# EAGLE design oc_oscillator (EAGLE 9.6.2)
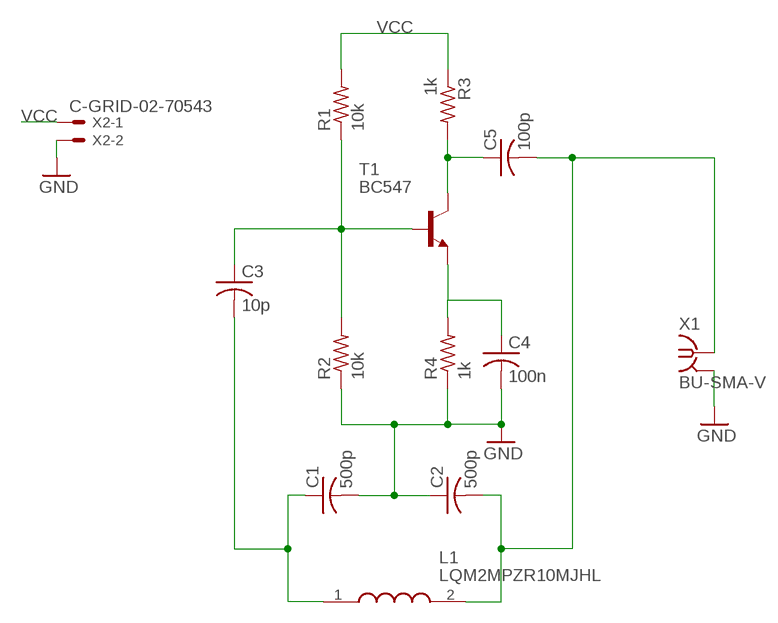
[diagram p0: schematic, sheet 1]

## Parts
C1  500p  C-USC0805  [C0805]
C2  500p  C-USC0805  [C0805]
C3  10p  C-USC0805  [C0805]
C4  100n  C-USC0805  [C0805]
C5  100p  C-USC0805  [C0805]
L1  LQM2MPZR10MJHL  [INDC2016X120N]
R1  10k  R-US_M0805  [M0805]
R2  10k  R-US_M0805  [M0805]
R3  1k  R-US_M0805  [M0805]
R4  1k  R-US_M0805  [M0805]
T1  BC547  [TO92]
X1  BU-SMA-V  [BU-SMA-V]
X2  C-GRID-02-70543  [70543-02]

## Nets
GND: C1.2 C2.1 C4.2 R2.1 R4.1 X1.2 X1.3 X1.4 X1.5 X2.2
N$1: C4.1 R4.2 T1.1(E)
N$2: C5.1 R3.2 T1.3(C)
N$3: C3.1 R1.1 R2.2 T1.2(B)
N$5: C1.1 C3.2 L1.1
N$6: C2.2 C5.2 L1.2 X1.1
VCC: R1.2 R3.1 X2.1

## Library data of the parts
C1-C5 = rcl:C-US: CAPACITOR, American symbol; SPICEPREFIX: C
L1 = LQM2MPZR10MJHL:LQM2MPZR10MJHL: LQM2MPZ_JH Series Inductor 0.1uH +/-20% 0806 (2016) Source: Datasheet <https://psearch.en.murata.com/inductor/product/LQM2MPZR10MJH#.html>; DESCRIPTION: LQM2MPZ_JH Series Inductor 0.1uH +/-20% 0806 (2016); HEIGHT: 1.2mm; MANUFACTURER_NAME: Murata Electronics; MANUFACTURER_PART_NUMBER: LQM2MPZR10MJHL; MOUSER_PART_NUMBER: 81-LQM2MPZR10MJHL; MOUSER_PRICE-STOCK: https://www.mouser.co.uk/ProductDetail/Murata-Electronics/LQM2MPZR10MJHL?qs=d0WKAl%252BL4KZJ7ssacSrcEg%3D%3D
R1-R4 = rcl:R-US_: RESISTOR, American symbol; SPICEPREFIX: R
T1 = transistor:BC547: NPN TRANSISTOR
X1 = con-coax:BU-SMA-V: FEMALE SMA CONNECTOR Radiall distributor RS 112-3794; OC_FARNELL: unknown; OC_NEWARK: unknown
X2 = con-molex:C-GRID-02: CONNECTOR wire to board 2.54 mm (0.100") pitch header; MF: MOLEX; OC_FARNELL: unknown; OC_NEWARK: unknown

## Board
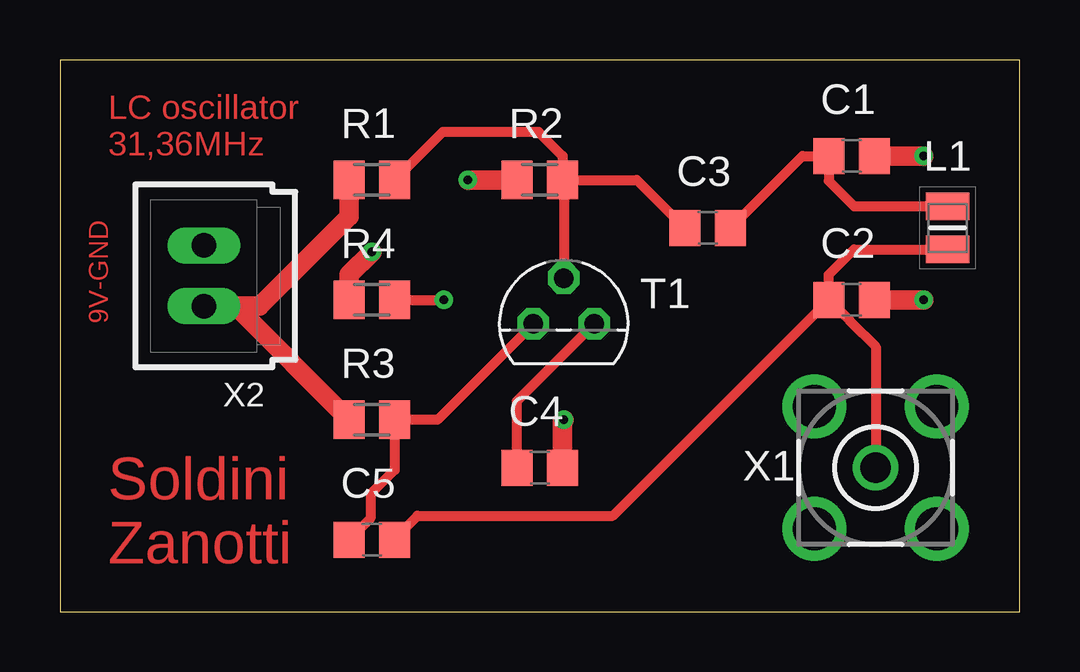
[diagram p1: board, top side]
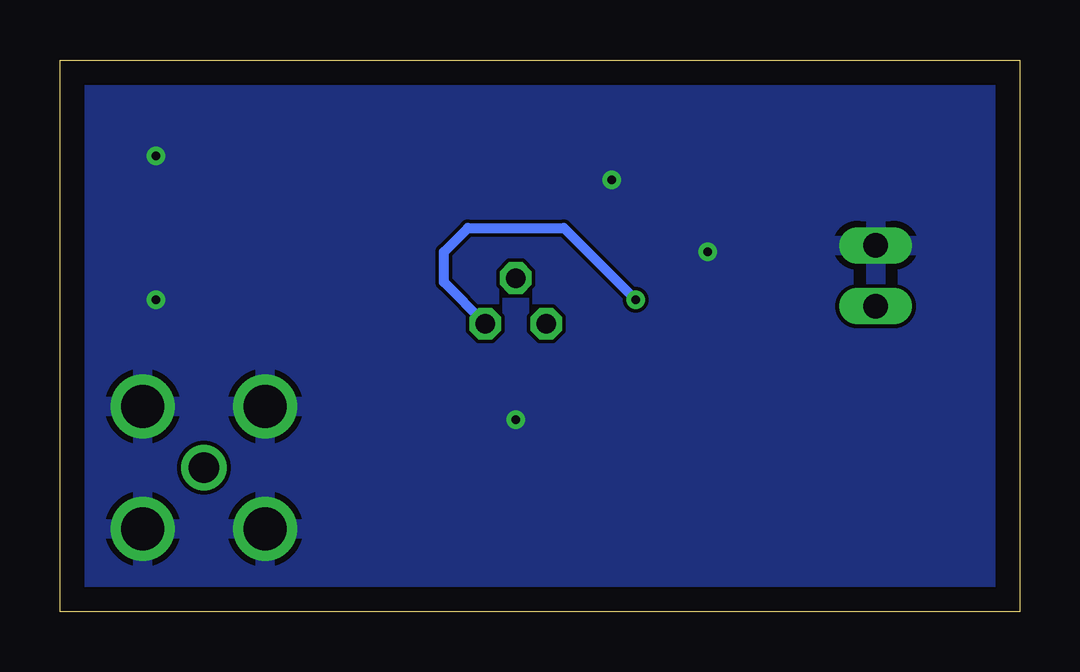
[diagram p2: board, bottom side, seen from below]

Size 40 x 23 mm. Coordinates in mm from the lower left corner, seen from the top.
Outline: 0,0 40,0 40,23 0,23 0,0
Copper layers (1*16): Top 0.035mm / dielectric 1.5mm / Bottom 0.035mm
Design rules "default": minimum track width 6mil, minimum drill 0.35mm, track to track 6mil, track to pad 6mil, pad to pad 6mil, via to via 6mil, smd to smd 6mil, copper to edge 40mil, drill to drill 6mil, minimum pad ring 10mil, minimum via ring 8mil, stop-mask expansion 4mil, vias tented up to drill 0mil, thermal gap 10mil

### Footprints (pad centres in the part's own frame; a part is rotated, then mirrored left to right if it is on the bottom)
C0805 = smd 1.3 x 1.5: 1 -0.95,0; 2 0.95,0
INDC2016X120N = smd 1.15 x 1.8: 1 -0.9,0; 2 0.9,0
M0805 = smd 1.3 x 1.6: 1 -0.95,0; 2 0.95,0
TO92 = drill 0.813 octagon: 1 1.27,0; 2 0,1.905; 3 -1.27,0
BU-SMA-V = drill 1.27: 1 0,0 | drill 1.778: 2 -2.55,2.55; 3 2.55,2.55; 4 2.55,-2.55; 5 -2.55,-2.55
70543-02 = drill 1.016 long: 1 -1.27,0; 2 1.27,0

### Placement (x,y rotation side)
C1  33,19 0 top
C2  33,13 180 top
C3  27,16 0 top
C4  20,6 0 top
C5  13,3 0 top
L1  37,16 270 top
R1  13,18 180 top
R2  20,18 0 top
R3  13,8 0 top
R4  13,13 0 top
T1  21,12 0 top
X1  34,6 0 top
X2  6,14 90 top

### Tracks (layer width: path | path; a pad name or v marks a point on that pad's centre or on a via)
GND  (via drill 0.35)
  Top 0.813: R2.1 v17,18 | R4.1 12.05,14.05 v13,15 | C4.2 20.95,7.95 v21,8 | C1.2 v36,19 | C2.1 v36,13
  pour Bottom: 0,0 40,0 40,23 0,23
N$1  (via drill 0.35)
  Top 0.406: C4.1 19.05,8.78 T1.1 | R4.2 v16,13
  Bottom 0.406: v16,13 19,16 23,16 24,15 24,13.73 T1.1
N$2
  Top 0.406: C5.1 12.94,3.89 12.94,4.9 13.95,5.9 R3.2 15.73,8 T1.3
N$3
  Top 0.406: R2.2 20.95,19 19.95,20 15.95,20 R1.1 | R2.2 21,17.95 T1.2 | R2.2 24.05,18 C3.1
N$5
  Top 0.406: L1.1 33.1,16.9 32.05,17.95 C1.1 30.95,19 C3.2
N$6
  Top 0.406: C5.2 13.9,3 14.9,4 23.05,4 C2.2 | C2.2 32.05,14.05 33.1,15.1 L1.2 | C2.2 32.94,12.11 32.94,12.1 34,11.05 X1.1
VCC
  Top 0.813: 12,18 R1.2 12.05,16.46 8.32,12.73 7.32,12.73 | X2.1 7.32,12.73 | 7.32,12.73 R3.1

### Text on the board
Top: LC oscillator / 31,36MHz | 9V-GND | Soldini / Zanotti